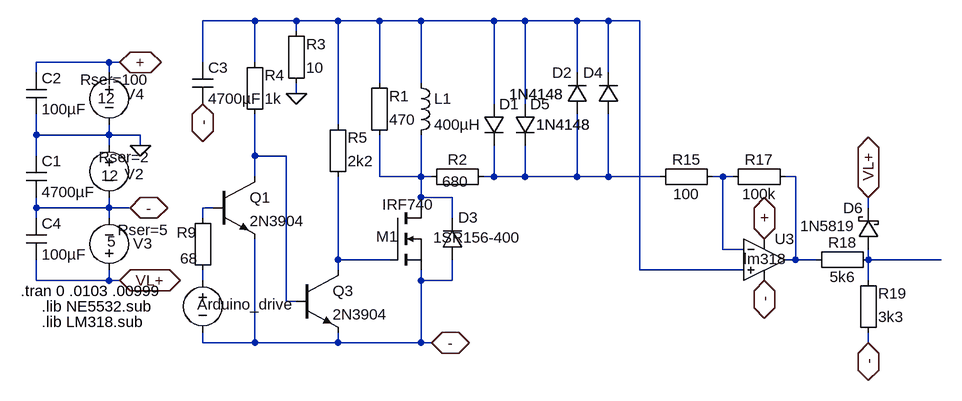
[diagram p0: schematic metal_1100.asc]
metal_1100.asc, the LTspice schematic file:
Version 4
SHEET 1 6068 1612
WIRE 144 -2416 64 -2416
WIRE 208 -2416 144 -2416
WIRE 272 -2416 208 -2416
WIRE 336 -2416 272 -2416
WIRE 400 -2416 336 -2416
WIRE 512 -2416 400 -2416
WIRE 560 -2416 512 -2416
WIRE 640 -2416 560 -2416
WIRE 688 -2416 640 -2416
WIRE 736 -2416 688 -2416
WIRE 208 -2400 208 -2416
WIRE -80 -2352 -192 -2352
WIRE -64 -2352 -80 -2352
WIRE 64 -2352 64 -2416
WIRE 144 -2352 144 -2416
WIRE -192 -2336 -192 -2352
WIRE -80 -2336 -80 -2352
WIRE 640 -2336 640 -2416
WIRE 688 -2336 688 -2416
WIRE 336 -2320 336 -2416
WIRE 400 -2320 400 -2416
WIRE 208 -2304 208 -2320
WIRE 512 -2288 512 -2416
WIRE 560 -2288 560 -2416
WIRE 272 -2256 272 -2416
WIRE -192 -2240 -192 -2272
WIRE -80 -2240 -80 -2256
WIRE -80 -2240 -192 -2240
WIRE -32 -2240 -80 -2240
WIRE -80 -2224 -80 -2240
WIRE -32 -2224 -32 -2240
WIRE -192 -2208 -192 -2240
WIRE 144 -2208 144 -2272
WIRE 192 -2208 144 -2208
WIRE 144 -2176 144 -2208
WIRE 336 -2176 336 -2240
WIRE 400 -2176 400 -2240
WIRE 400 -2176 336 -2176
WIRE 416 -2176 400 -2176
WIRE 512 -2176 512 -2224
WIRE 512 -2176 496 -2176
WIRE 560 -2176 560 -2224
WIRE 560 -2176 512 -2176
WIRE 640 -2176 640 -2272
WIRE 640 -2176 560 -2176
WIRE 688 -2176 688 -2272
WIRE 688 -2176 640 -2176
WIRE 768 -2176 688 -2176
WIRE 864 -2176 848 -2176
WIRE 880 -2176 864 -2176
WIRE 976 -2176 960 -2176
WIRE 400 -2144 400 -2176
WIRE 448 -2144 400 -2144
WIRE -192 -2128 -192 -2144
WIRE -80 -2128 -80 -2144
WIRE -80 -2128 -192 -2128
WIRE -48 -2128 -80 -2128
WIRE 80 -2128 64 -2128
WIRE 400 -2128 400 -2144
WIRE 1088 -2128 1088 -2144
WIRE -192 -2112 -192 -2128
WIRE -80 -2112 -80 -2128
WIRE 64 -2112 64 -2128
WIRE 448 -2112 448 -2144
WIRE 864 -2064 864 -2176
WIRE 896 -2064 864 -2064
WIRE 272 -2048 272 -2176
WIRE 352 -2048 272 -2048
WIRE 976 -2048 976 -2176
WIRE 976 -2048 960 -2048
WIRE 1008 -2048 976 -2048
WIRE 1088 -2048 1088 -2064
WIRE 1200 -2048 1088 -2048
WIRE 272 -2032 272 -2048
WIRE 736 -2032 736 -2416
WIRE 896 -2032 736 -2032
WIRE -192 -2016 -192 -2048
WIRE -80 -2016 -80 -2032
WIRE -80 -2016 -192 -2016
WIRE -64 -2016 -80 -2016
WIRE 64 -2016 64 -2032
WIRE 400 -2016 400 -2032
WIRE 448 -2016 448 -2048
WIRE 448 -2016 400 -2016
WIRE 1088 -2016 1088 -2048
WIRE 192 -1984 192 -2208
WIRE 208 -1984 192 -1984
WIRE 64 -1920 64 -1936
WIRE 144 -1920 144 -2080
WIRE 144 -1920 64 -1920
WIRE 272 -1920 272 -1936
WIRE 272 -1920 144 -1920
WIRE 400 -1920 400 -2016
WIRE 400 -1920 272 -1920
WIRE 416 -1920 400 -1920
WIRE 1088 -1920 1088 -1936
FLAG 64 -2288 -
IOPIN 64 -2288 BiDir
FLAG -48 -2128 -
IOPIN -48 -2128 BiDir
FLAG -64 -2352 +
IOPIN -64 -2352 BiDir
FLAG -32 -2224 0
FLAG 208 -2304 0
FLAG -64 -2016 VL+
IOPIN -64 -2016 BiDir
FLAG 928 -2080 +
IOPIN 928 -2080 BiDir
FLAG 928 -2016 -
IOPIN 928 -2016 BiDir
FLAG 1088 -1920 -
IOPIN 1088 -1920 BiDir
FLAG 1088 -2144 VL+
IOPIN 1088 -2144 BiDir
FLAG 416 -1920 -
IOPIN 416 -1920 BiDir
SYMBOL Misc\\EuropeanCap 48 -2352 R0
SYMATTR InstName C3
SYMATTR Value 4700µF
SYMATTR SpiceLine V=400 Irms=1 Rser=.32 Lser=0
SYMBOL ind 384 -2336 R0
SYMATTR InstName L1
SYMATTR Value 400µH
SYMATTR SpiceLine Rser=.5 Cpar=200p
SYMBOL Misc\\EuropeanResistor 320 -2224 M180
WINDOW 0 31 76 Left 2
WINDOW 3 31 40 Left 2
SYMATTR InstName R1
SYMATTR Value 470
SYMBOL Misc\\EuropeanResistor 400 -2192 M90
WINDOW 0 5 56 VBottom 2
WINDOW 3 8 53 VTop 2
SYMATTR InstName R2
SYMATTR Value 680
SYMBOL diode 496 -2288 R0
WINDOW 3 81 32 Left 2
SYMATTR Value 1N4148
SYMATTR InstName D1
SYMBOL diode 656 -2272 R180
WINDOW 0 24 64 Left 2
WINDOW 3 36 31 Left 2
SYMATTR InstName D2
SYMATTR Value 1N4148
SYMBOL Misc\\EuropeanResistor 192 -2304 M180
WINDOW 0 31 76 Left 2
WINDOW 3 31 40 Left 2
SYMATTR InstName R3
SYMATTR Value 10
SYMBOL nmos 352 -2128 R0
WINDOW 0 -21 44 Left 2
WINDOW 3 -12 -5 Left 2
SYMATTR InstName M1
SYMATTR Value IRF740
SYMBOL voltage 64 -2032 M0
WINDOW 0 -141 53 Left 2
WINDOW 3 -134 119 Invisible 2
WINDOW 123 0 0 Left 2
SYMATTR InstName Arduino_drive
SYMATTR Value PULSE(0 4.8 .01 0 0 .00015 .1 1000)
SYMATTR SpiceLine Rser=0
SYMBOL voltage -80 -2240 M0
WINDOW 123 0 0 Left 2
WINDOW 39 -63 34 Left 2
WINDOW 0 -53 60 Left 2
WINDOW 3 -15 62 Left 2
SYMATTR SpiceLine Rser=2
SYMATTR InstName V2
SYMATTR Value 12
SYMBOL voltage -80 -2352 M0
WINDOW 123 0 0 Left 2
WINDOW 39 -61 27 Left 2
WINDOW 0 -54 49 Left 2
WINDOW 3 -9 55 Left 2
SYMATTR SpiceLine Rser=100
SYMATTR InstName V4
SYMATTR Value 12
SYMBOL voltage -80 -2016 M180
WINDOW 123 0 0 Left 2
WINDOW 39 13 78 Left 2
WINDOW 0 37 57 Left 2
WINDOW 3 -3 60 Left 2
SYMATTR SpiceLine Rser=5
SYMATTR InstName V3
SYMATTR Value 5
SYMBOL npn3 80 -2176 R0
SYMATTR InstName Q1
SYMATTR Value 2N3904
SYMBOL Misc\\EuropeanResistor 128 -2256 M180
WINDOW 0 31 76 Left 2
WINDOW 3 31 40 Left 2
SYMATTR InstName R4
SYMATTR Value 1k
SYMBOL Misc\\EuropeanResistor 48 -2016 M180
WINDOW 0 -24 74 Left 2
WINDOW 3 -19 34 Left 2
SYMATTR InstName R9
SYMATTR Value 68
SYMBOL diode 704 -2272 R180
WINDOW 0 24 64 Left 2
WINDOW 3 84 31 Left 2
SYMATTR InstName D4
SYMATTR Value 1N4148
SYMBOL diode 544 -2288 R0
WINDOW 3 33 32 Left 2
SYMATTR Value 1N4148
SYMATTR InstName D5
SYMBOL Misc\\EuropeanCap -208 -2208 R0
SYMATTR InstName C1
SYMATTR Value 4700µF
SYMATTR SpiceLine V=400 Irms=1 Rser=.32 Lser=0
SYMBOL Misc\\EuropeanCap -208 -2336 R0
SYMATTR InstName C2
SYMATTR Value 100µF
SYMATTR SpiceLine V=400 Irms=1 Rser=.32 Lser=0
SYMBOL Misc\\EuropeanCap -208 -2112 R0
SYMATTR InstName C4
SYMATTR Value 100µF
SYMATTR SpiceLine V=400 Irms=1 Rser=.32 Lser=0
SYMBOL Opamps\\opamp2 928 -2112 R0
WINDOW 3 -32 63 Left 2
SYMATTR Value lm318
SYMATTR InstName U3
SYMBOL Misc\\EuropeanResistor 752 -2160 R270
WINDOW 0 27 56 VTop 2
WINDOW 3 5 56 VBottom 2
SYMATTR InstName R15
SYMATTR Value 100
SYMBOL Misc\\EuropeanResistor 864 -2160 R270
WINDOW 0 27 56 VTop 2
WINDOW 3 5 56 VBottom 2
SYMATTR InstName R17
SYMATTR Value 100k
SYMBOL Misc\\EuropeanResistor 992 -2032 R270
WINDOW 0 27 56 VTop 2
WINDOW 3 5 56 VBottom 2
SYMATTR InstName R18
SYMATTR Value 5k6
SYMBOL Misc\\EuropeanResistor 1072 -1920 M180
WINDOW 0 31 76 Left 2
WINDOW 3 31 40 Left 2
SYMATTR InstName R19
SYMATTR Value 3k3
SYMBOL schottky 1104 -2064 R180
WINDOW 0 24 64 Left 2
WINDOW 3 36 36 Left 2
SYMATTR InstName D6
SYMATTR Value 1N5819
SYMATTR Description Diode
SYMATTR Type diode
SYMBOL npn3 208 -2032 R0
SYMATTR InstName Q3
SYMATTR Value 2N3904
SYMBOL diode 464 -2048 R180
WINDOW 0 -24 65 Left 2
WINDOW 3 -90 34 Left 2
SYMATTR InstName D3
SYMATTR Value 1SR156-400
SYMATTR Description Zener Diode
SYMATTR Type zener
SYMBOL Misc\\EuropeanResistor 256 -2160 M180
WINDOW 0 31 76 Left 2
WINDOW 3 31 40 Left 2
SYMATTR InstName R5
SYMATTR Value 2k2
TEXT -216 -2000 Left 2 !.tran 0 .0103 .00999
TEXT -184 -1976 Left 2 !.lib NE5532.sub
TEXT -184 -1952 Left 2 !.lib LM318.sub

The netlist it stands for:
* metal_1100.asc
C3 N001 - 4700µF V=400 Irms=1 Rser=.32 Lser=0
L1 N001 N003 400µH Rser=.5 Cpar=200p
R1 N003 N001 470
R2 N003 N004 680
D1 N001 N004 1N4148
D2 N004 N001 1N4148
R3 0 N001 10
M1 N003 N008 - - IRF740
V§Arduino_drive N010 - PULSE(0 4.8 .01 0 0 .00015 .1 1000) Rser=0
V2 0 - 12 Rser=2
V4 + 0 12 Rser=100
V3 VL+ - 5 Rser=5
Q1 N002 N007 - 0 2N3904
R4 N002 N001 1k
R9 N010 N007 68
D4 N004 N001 1N4148
D5 N001 N004 1N4148
C1 0 - 4700µF V=400 Irms=1 Rser=.32 Lser=0
C2 + 0 100µF V=400 Irms=1 Rser=.32 Lser=0
C4 - VL+ 100µF V=400 Irms=1 Rser=.32 Lser=0
XU3 N001 N005 + - N006 lm318  ; pins In+ In- V+ V- OUT
R15 N004 N005 100
R17 N005 N006 100k
R18 N006 N009 5k6
R19 - N009 3k3
D6 N009 VL+ 1N5819
Q3 N008 N002 - 0 2N3904
D3 - N003 1SR156-400
R5 N008 N001 2k2
.model D D
.lib standard.dio
.model NPN NPN
.model PNP PNP
.lib standard.bjt
.model NMOS NMOS
.model PMOS PMOS
.lib standard.mos
.tran 0 .0103 .00999
.lib NE5532.sub
.lib LM318.sub
.backanno
.end